# EAGLE design NMX-2017 (EAGLE 8.4.3)
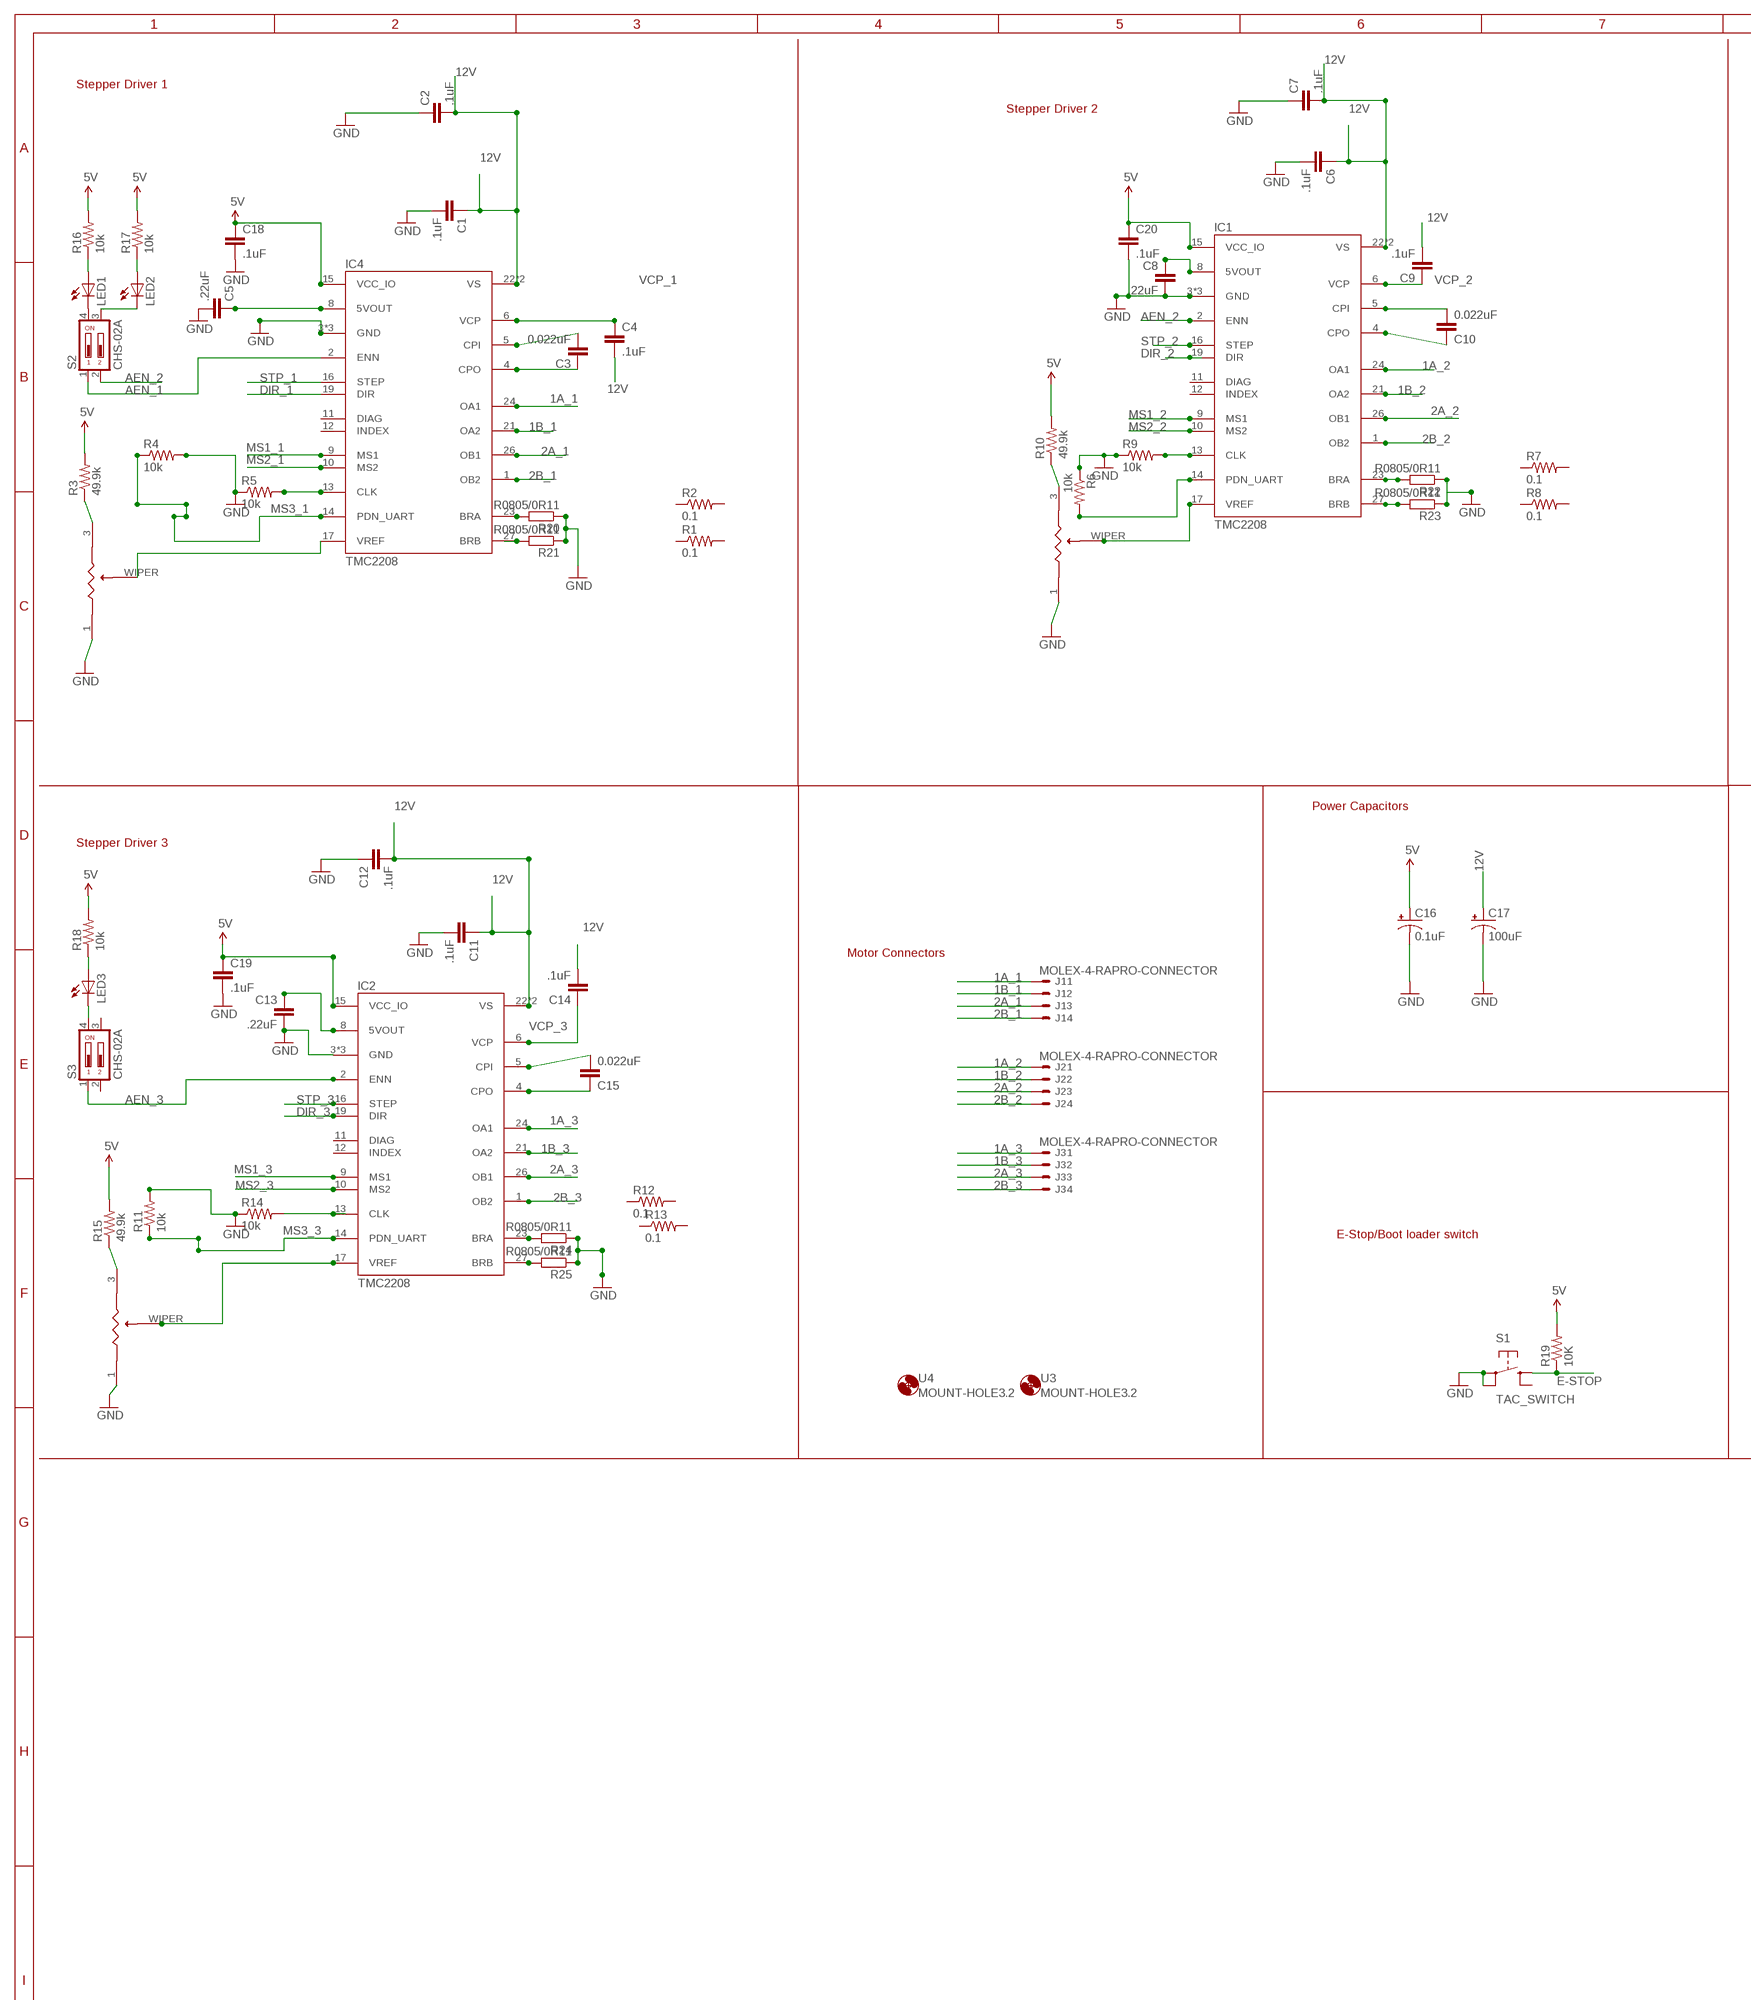
[diagram p0: schematic, sheet 1, part 1 of 2]
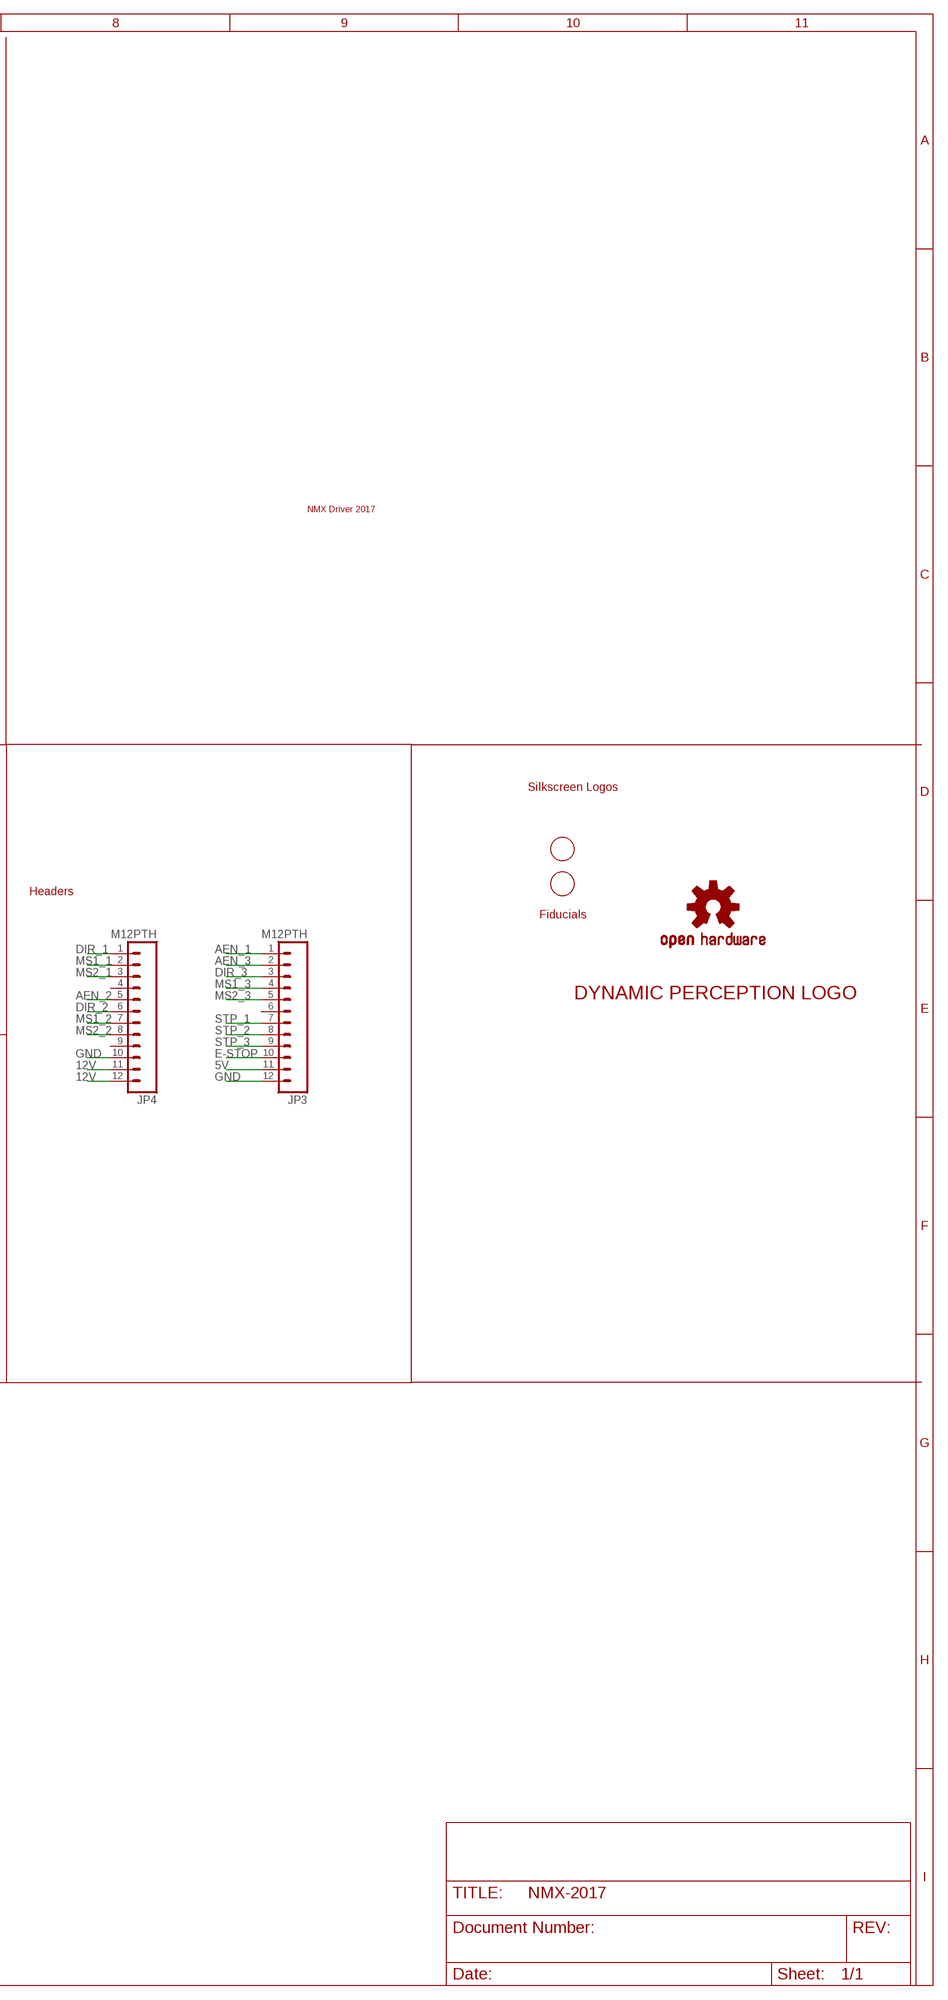
[diagram p1: schematic, sheet 1, part 2 of 2]

## Parts
C1  .1uF  CAP0402-CAP  [0402-CAP]
C2  .1uF  CAP0402-CAP  [0402-CAP]
C3  0.022uF  CAP0402-CAP  [0402-CAP]
C4  .1uF  CAP0402-CAP  [0402-CAP]
C5  .22uF  CAP0402-CAP  [0402-CAP]
C6  .1uF  CAP0402-CAP  [0402-CAP]
C7  .1uF  CAP0402-CAP  [0402-CAP]
C8  .22uF  CAP0402-CAP  [0402-CAP]
C9  .1uF  CAP0402-CAP  [0402-CAP]
C10  0.022uF  CAP0402-CAP  [0402-CAP]
C11  .1uF  CAP0402-CAP  [0402-CAP]
C12  .1uF  CAP0402-CAP  [0402-CAP]
C13  .22uF  CAP0402-CAP  [0402-CAP]
C14  .1uF  CAP0402-CAP  [0402-CAP]
C15  0.022uF  CAP0402-CAP  [0402-CAP]
C16  0.1uF  CAP_POL1206  [EIA3216]
C17  100uF  CAP_POLD  [PANASONIC_D]
C18  .1uF  CAP0402-CAP  [0402-CAP]
C19  .1uF  CAP0402-CAP  [0402-CAP]
C20  .1uF  CAP0402-CAP  [0402-CAP]
IC1  TMC2208  [QFN28-PAD]
IC2  TMC2208  [QFN28-PAD]
IC4  TMC2208  [QFN28-PAD]
J1  MOLEX-4-RAPRO-CONNECTOR  [PRO_CONNECTOR]
J2  MOLEX-4-RAPRO-CONNECTOR  [PRO_CONNECTOR]
J3  MOLEX-4-RAPRO-CONNECTOR  [PRO_CONNECTOR]
JP3  M12PTH  [1X12]
JP4  M12PTH  [1X12]
LED1  LED0603  [LED-0603]
LED2  LED0603  [LED-0603]
LED3  LED0603  [LED-0603]
R1  0.1  R-US_R0603  [R0603]
R2  0.1  R-US_R0603  [R0603]
R3  49.9k  R-US_R0402_B  [R0402_BOTTOM]
R4  10k  R-US_R0402_B  [R0402_BOTTOM]
R5  10k  R-US_R0402_B  [R0402_BOTTOM]
R6  10k  R-US_R0402_B  [R0402_BOTTOM]
R7  0.1  R-US_R0603  [R0603]
R8  0.1  R-US_R0603  [R0603]
R9  10k  R-US_R0402_B  [R0402_BOTTOM]
R10  49.9k  R-US_R0402_B  [R0402_BOTTOM]
R11  10k  R-US_R0402_B  [R0402_BOTTOM]
R12  0.1  R-US_R0603  [R0603]
R13  0.1  R-US_R0603  [R0603]
R14  10k  R-US_R0402_B  [R0402_BOTTOM]
R15  49.9k  R-US_R0402_B  [R0402_BOTTOM]
R16  10k  R-US_R0402_B  [R0402_BOTTOM]
R17  10k  R-US_R0402_B  [R0402_BOTTOM]
R18  10k  R-US_R0402_B  [R0402_BOTTOM]
R19  10K  R-US_R0402_B  [R0402_BOTTOM]
R20  R0805/0R11  R-EU_M0805  [M0805]
R21  R0805/0R11  R-EU_M0805  [M0805]
R22  R0805/0R11  R-EU_M0805  [M0805]
R23  R0805/0R11  R-EU_M0805  [M0805]
R24  R0805/0R11  R-EU_M0805  [M0805]
R25  R0805/0R11  R-EU_M0805  [M0805]
S1  TAC_SWITCH  [TAC_SWITCH_THR]
S2  CHS-02A  [CHS-02A]
S3  CHS-02A  [CHS-02A]
U1  CADJ  TC33X-2  [3MM_SMD]
U2  CADJ  TC33X-2  [3MM_SMD]
U3  MOUNT-HOLE3.2  [3,2]
U4  MOUNT-HOLE3.2  [3,2]
U5  CADJ  TC33X-2  [3MM_SMD]
U$1  DP_LOGOMICRO  [DP_LOGO_MICRO]
U$2  OSHW-LOGOS  [OSHW-LOGO-S]
U$3  FIDUCIAL  [FIDUCIAL_1MM]
U$4  FIDUCIAL  [FIDUCIAL_1MM]

## Nets
1A_1 [StepperPower]: IC4.24(OA1) J1.P$1
1A_2 [StepperPower]: IC1.24(OA1) J2.P$1
1A_3 [StepperPower]: IC2.24(OA1) J3.P$1
1B_1 [StepperPower]: IC4.21(OA2) J1.P$2
1B_2 [StepperPower]: IC1.21(OA2) J2.P$2
1B_3 [StepperPower]: IC2.21(OA2) J3.P$2
2A_1 [StepperPower]: IC4.26(OB1) J1.P$3
2A_2 [StepperPower]: IC1.26(OB1) J2.P$3
2A_3 [StepperPower]: IC2.26(OB1) J3.P$3
2B_1 [StepperPower]: IC4.1(OB2) J1.P$4
2B_2 [StepperPower]: IC1.1(OB2) J2.P$4
2B_3 [StepperPower]: IC2.1(OB2) J3.P$4
5V [vccControllers]: C16.A(+) C18.1 C19.1 C20.1 IC1.15(VCC_IO) IC2.15(VCC_IO) IC4.15(VCC_IO) JP3.11 R3.2 R10.2 R15.2 R16.2 R17.2 R18.2 R19.2
12V [vcc]: C1.1 C2.2 C4.2 C6.1 C7.2 C9.2 C11.1 C12.2 C14.2 C17.+ IC1.22(VS) IC1.28(VS) IC2.22(VS) IC2.28(VS) IC4.22(VS) IC4.28(VS) JP4.11 JP4.12
AEN_1: IC4.2(ENN) JP3.1 S2.1
AEN_2: IC1.2(ENN) JP4.5 S2.2
AEN_3: IC2.2(ENN) JP3.2 S3.1
DIR_1: IC4.19(DIR) JP4.1
DIR_2: IC1.19(DIR) JP4.6
DIR_3: IC2.19(DIR) JP3.3
E-STOP: JP3.10 R19.1 S1.B
GND [gnd]: C1.2 C2.1 C5.2 C6.2 C7.1 C8.2 C11.2 C12.1 C13.2 C16.C(-) C17.- C18.2 C19.2 C20.2 IC1.3(GND) IC1.18(GND) IC1.TP(GND) IC2.3(GND) IC2.18(GND) IC2.TP(GND) IC4.3(GND) IC4.18(GND) IC4.TP(GND) JP3.12 JP4.10 R4.2 R5.1 R6.1 R9.1 R11.2 R14.1 R20.1 R21.1 R22.1 R23.1 R24.1 R25.1 S1.A S1.P$1 U1.1 U2.1 U5.1
MS1_1: IC4.9(MS1) JP4.2
MS1_2: IC1.9(MS1) JP4.7
MS1_3: IC2.9(MS1) JP3.4
MS2_1: IC4.10(MS2) JP4.3
MS2_2: IC1.10(MS2) JP4.8
MS2_3: IC2.10(MS2) JP3.5
MS3_1: IC4.14(PDN_UART) R4.1
MS3_2: IC1.14(PDN_UART) R6.2
MS3_3: IC2.14(PDN_UART) R11.1
N$1: C10.1 IC1.4(CPO)
N$2: C10.2 IC1.5(CPI)
N$5: IC1.17(VREF) U2.WIPER
N$6: R10.1 U2.3
N$7: C15.1 IC2.4(CPO)
N$8: C15.2 IC2.5(CPI)
N$10: IC2.23(BRA) R24.2
N$11: IC2.17(VREF) U5.WIPER
N$12: R15.1 U5.3
N$13: LED1.A R16.1
N$14: LED2.A R17.1
N$15: LED3.A R18.1
N$16: LED1.C S2.4
N$18: LED2.C S2.3
N$19: LED3.C S3.4
N$20: IC2.27(BRB) R25.2
N$21: C3.1 IC4.4(CPO)
N$22: C3.2 IC4.5(CPI)
N$23: IC1.23(BRA) R22.2
N$24 [vcc]: IC4.27(BRB) R21.2
N$26: IC4.17(VREF) U1.WIPER
N$28: R3.1 U1.3
N$29: IC4.23(BRA) R20.2
N$32: IC1.27(BRB) R23.2
ROSC1: IC4.13(CLK) R5.2
ROSC2: IC1.13(CLK) R9.2
ROSC3: IC2.13(CLK) R14.2
STP_1: IC4.16(STEP) JP3.7
STP_2: IC1.16(STEP) JP3.8
STP_3: IC2.16(STEP) JP3.9
VCP_1: C4.1 IC4.6(VCP)
VCP_2: C9.1 IC1.6(VCP)
VCP_3: C14.1 IC2.6(VCP)
VREG1: C5.1 IC4.8(5VOUT)
VREG2: C8.1 IC1.8(5VOUT)
VREG3: C13.1 IC2.8(5VOUT)
Unconnected: IC1.11(DIAG) IC1.12(INDEX) IC2.11(DIAG) IC2.12(INDEX) IC4.11(DIAG) IC4.12(INDEX) JP3.6 JP4.4 JP4.9 R1.1 R1.2 R2.1 R2.2 R7.1 R7.2 R8.1 R8.2 R12.1 R12.2 R13.1 R13.2 S1.P$2 S3.2 S3.3

## Notes on the sheet
- Stepper Driver 1
- Stepper Driver 2
- NMX Driver 2017
- Power Capacitors
- Silkscreen Logos
- Stepper Driver 3
- Headers
- Motor Connectors
- Fiducials
- E-Stop/Boot loader switch

## Library data of the parts
C1-C4 C6 C7 C9-C12 C14 C15 C18-C20 = SparkFun-Capacitors:CAP: Capacitor Standard 0603 ceramic capacitor, and 0.1" leaded capacitor.; MF: Taiyo Yuden; MPN: TMK105BJ104KV-F
C5 C8 C13 = SparkFun-Capacitors:CAP: Capacitor Standard 0603 ceramic capacitor, and 0.1" leaded capacitor.; MF: Taiyo Yuden; MPN: TMK105BJ224KVHF
C16 = SparkFun-Capacitors:CAP_POL: Capacitor Polarized These are standard SMD and PTH capacitors. Normally 10uF, 47uF, and 100uF in electrolytic and tantalum varieties. Always verify the external diameter of the through hole cap, it varies with capacity, voltage, and manufacturer. The EIA devices should be standard.; MF: Kemet; MPN: T491A106M016AT
C17 = SparkFun-Capacitors:CAP_POL: Capacitor Polarized These are standard SMD and PTH capacitors. Normally 10uF, 47uF, and 100uF in electrolytic and tantalum varieties. Always verify the external diameter of the through hole cap, it varies with capacity, voltage, and manufacturer. The EIA devices should be standard.; MF: Panasonic Electronic Components; MPN: EEE-1EA101XP
IC1 IC2 IC4 = we-chip:TMC2208: Trinamic TMC2108 Stepper Motor Driver (5V...36V, 1.2A RMS, 256 microsteps)
J1-J3 = NMX_StepperSide_V1-2:MOLEX-4-RA; MF: Molex Inc; MPN: 0022053041
JP3 JP4 = SparkFun-Connectors:M12: Header 12 Standard 12-pin 0.1" header. Use with straight break away headers (SKU : PRT-00116), right angle break away headers (PRT-00553), swiss pins (PRT-00743), machine pins (PRT-00117), and female headers (PRT-00115).; MF: Molex Inc; MPN: 0901200132
LED1-LED3 = SparkFun-LED:LED: LEDs Standard schematic elements and footprints for 5mm, 3mm, 1206, and 0603 sized LEDs. 5mm - Spark Fun Electronics SKU : COM-00529 (and others); MF: OSRAM Opto Semiconductors Inc; MPN: LB Q39G-L2N2-35-1
R1 R2 R7 R8 R12 R13 = resistor:R-US_: RESISTOR, American symbol; MF: Samsung Electro-Mechanics America; MPN: RU1608FR100CS
R3 R10 R15 = resistor:R-US_: RESISTOR, American symbol; MF: Yageo; MPN: RC0402FR-0749K9L
R4-R6 R9 R11 R14 = resistor:R-US_: RESISTOR, American symbol; MF: Yageo; MPN: RC0402FR-0720KL
R16-R18 = resistor:R-US_: RESISTOR, American symbol; MF: Yageo; MPN: RC0402FR-0714KL
R19 = resistor:R-US_: RESISTOR, American symbol; MF: Yageo; MPN: RC0402FR-0710KL
R20-R25 = rcl:R-EU_: RESISTOR, European symbol
S1 = QS_Components:TAC_SWITCH; MF: TE Connectivity; MPN: 2-1825027-0
S2 S3 = switch-copal:CHS-02: Copal Electronics, Distributor Bürklin
U1 U2 U5 = QS_Components:TC33X-2; MF: Bourns Inc; MPN: TC33X-2-103E
U3 U4 = holes:MOUNT-HOLE: MOUNTING HOLE with drill center marker
U$1 = QS_Components:DP_LOGO
U$2 = SparkFun-Aesthetics:OSHW-LOGO: Open Source Hardware Logo This logo indicates the piece of hardware it is found on incorporates a OSHW license and/or adheres to the definition of open source hardware found here: http://freedomdefined.org/OSHW
U$3 U$4 = adafruit:FIDUCIAL: For use by pick and place machines to calibrate the vision/machine, 1mm By microbuilder.eu

## Net classes
0 default: width 0.203 mm, drill 0.254 mm, clearance 0.152 mm
1 vcc: width 0.635 mm, drill 0.254 mm, clearance 0.152 mm
2 gnd: width 0.254 mm, drill 0.254 mm, clearance 0.152 mm
3 vccControllers: width 0.305 mm, drill 0.254 mm, clearance 0.152 mm
4 StepperPower: width 0.635 mm, drill 0.254 mm, clearance 0.152 mm

## Board
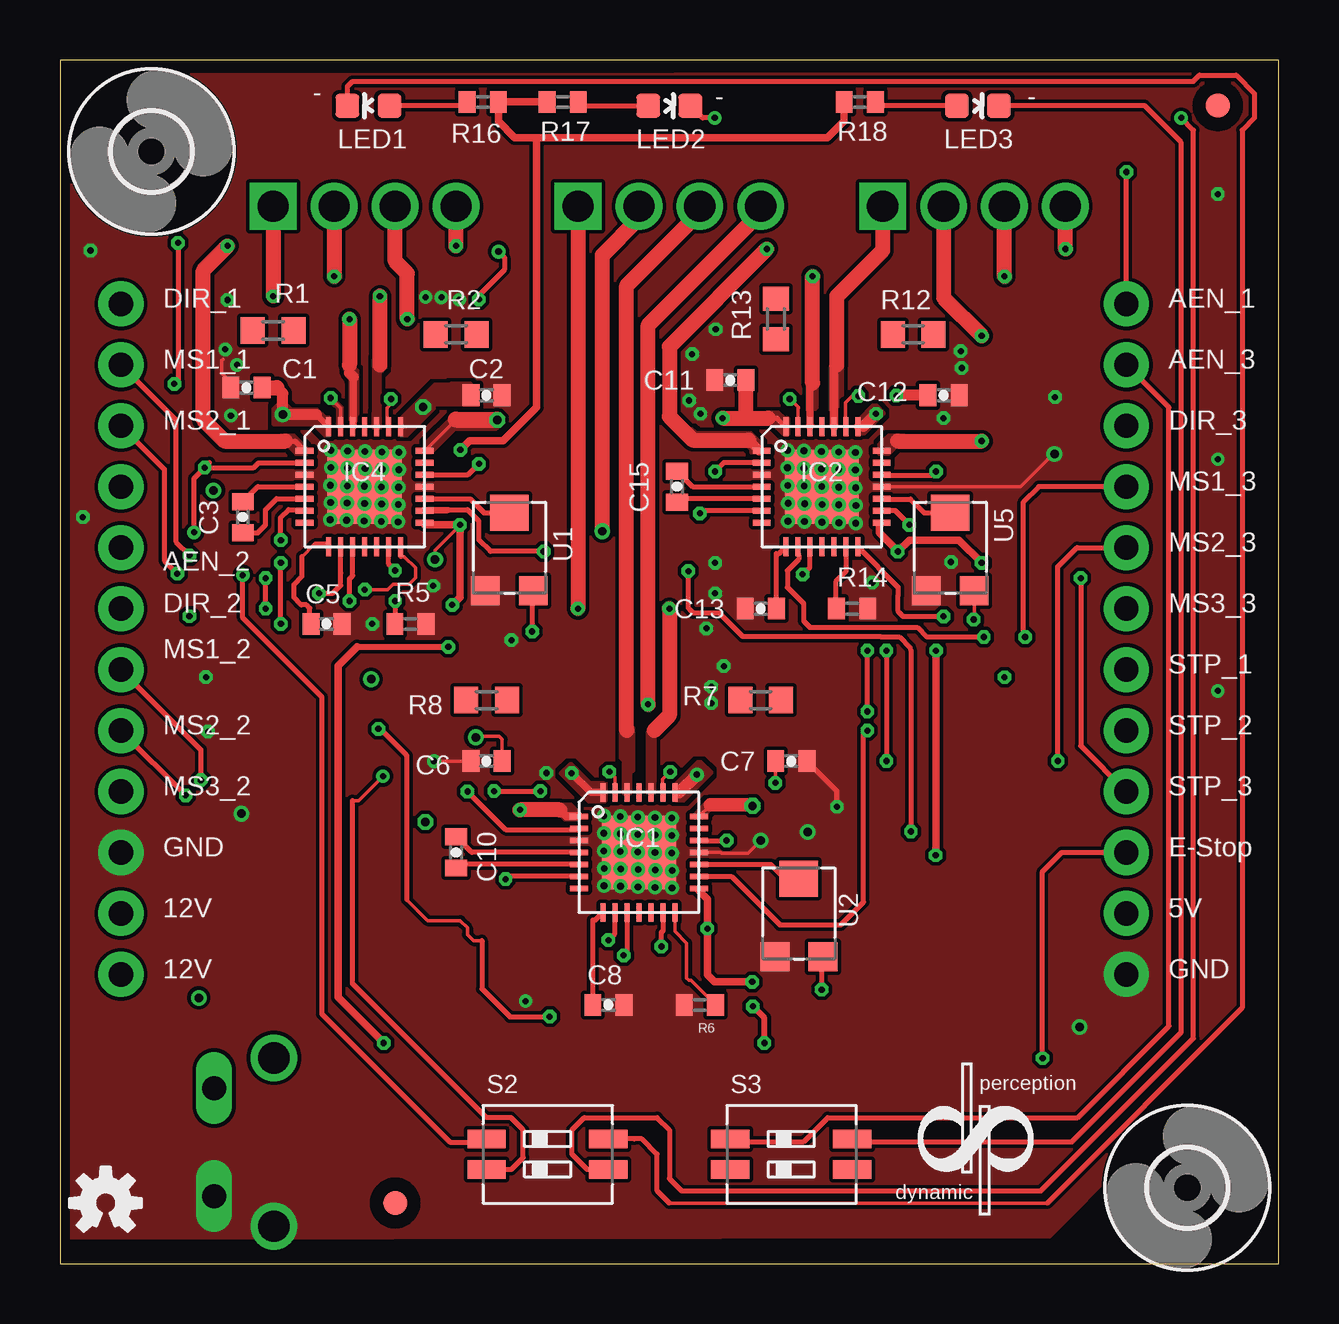
[diagram p2: board, top side]
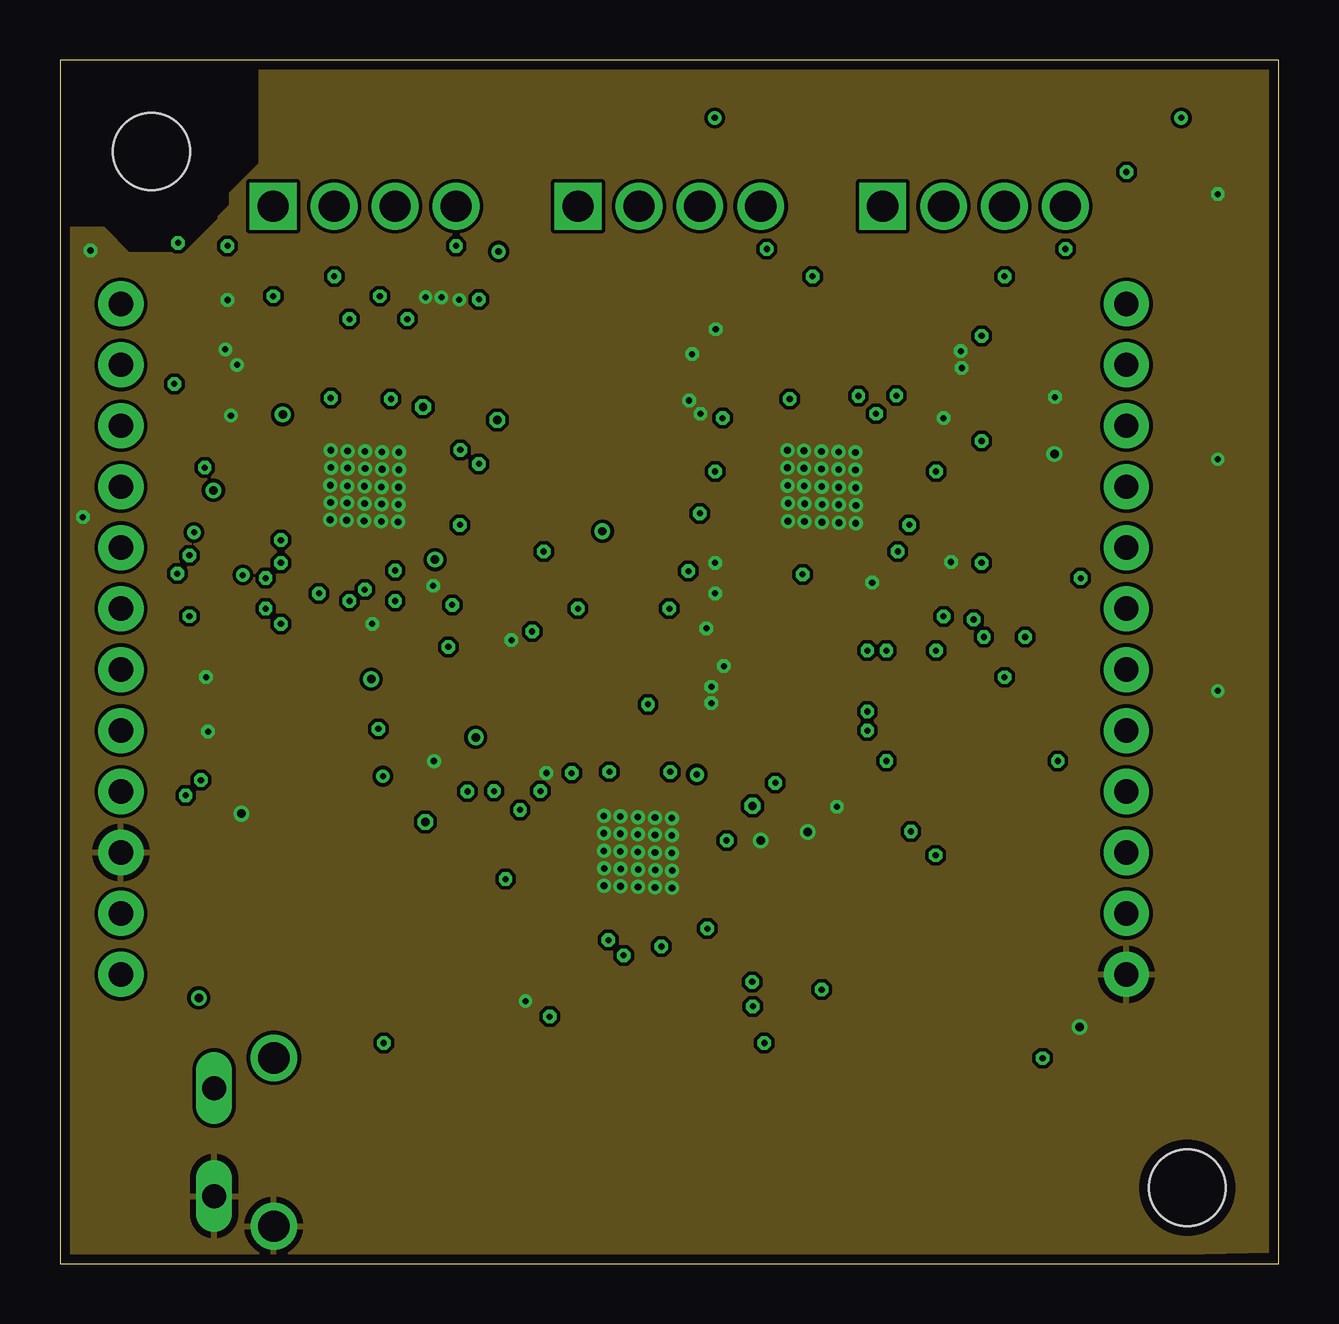
[diagram p3: board, inner layer Ground]
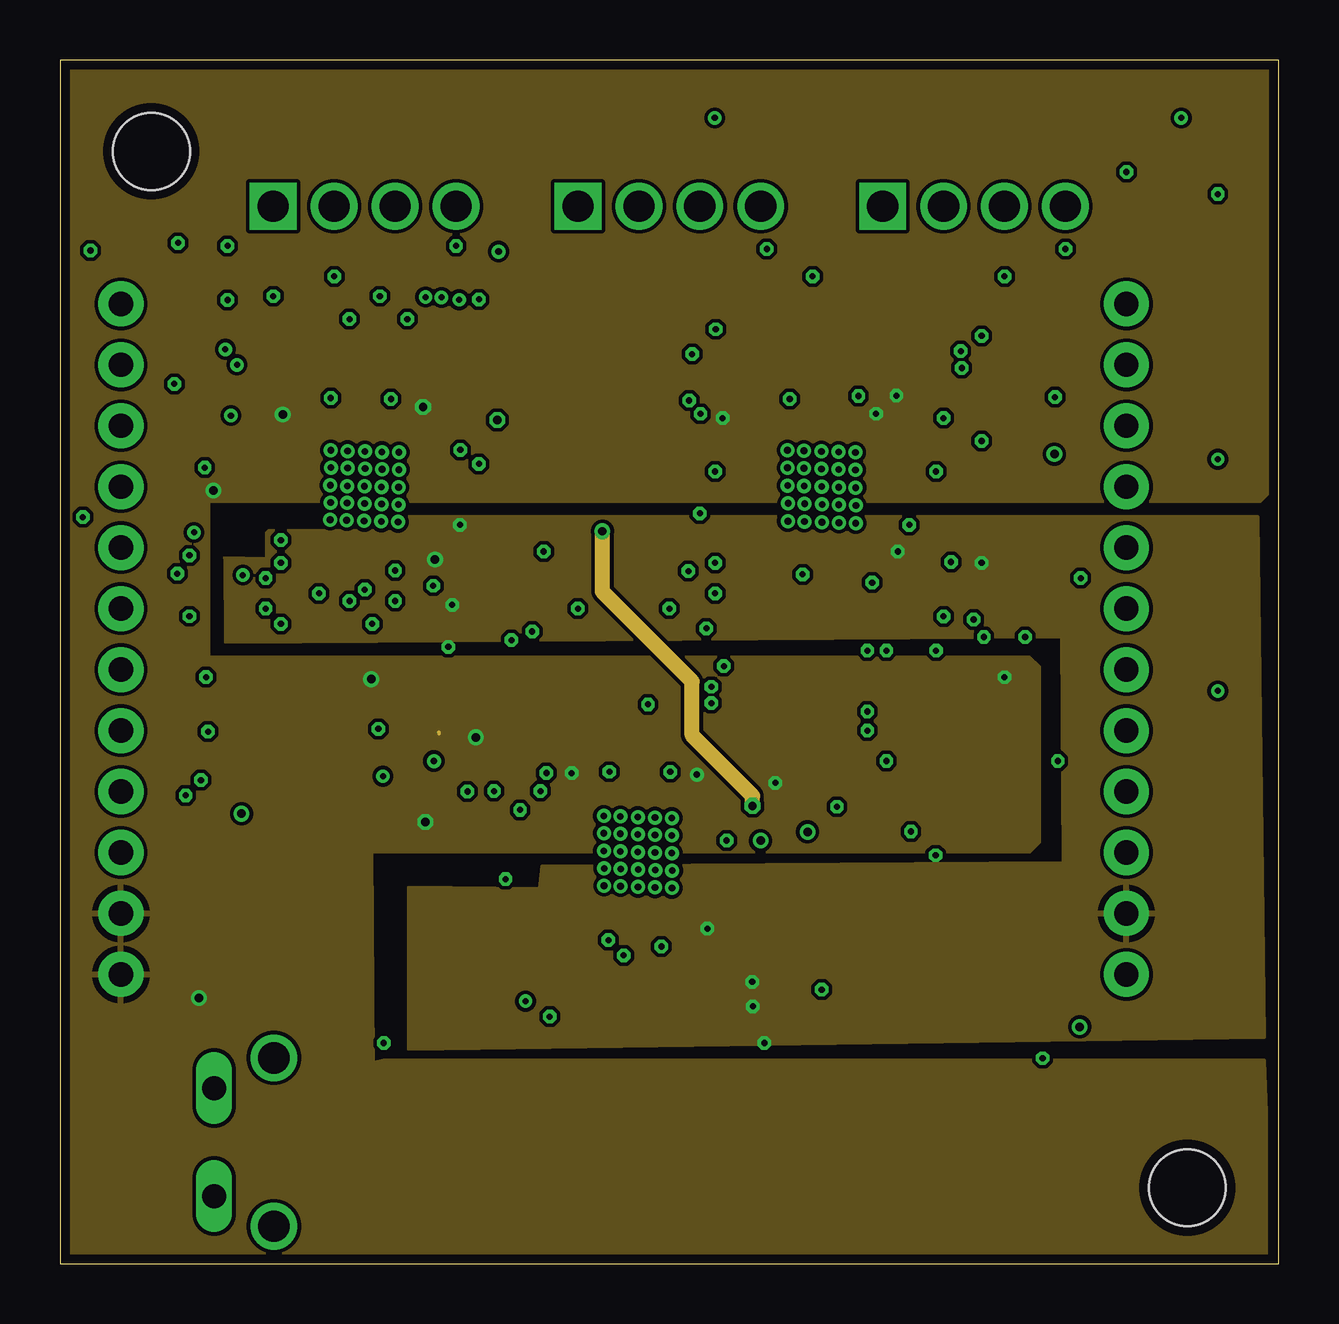
[diagram p4: board, inner layer Power]
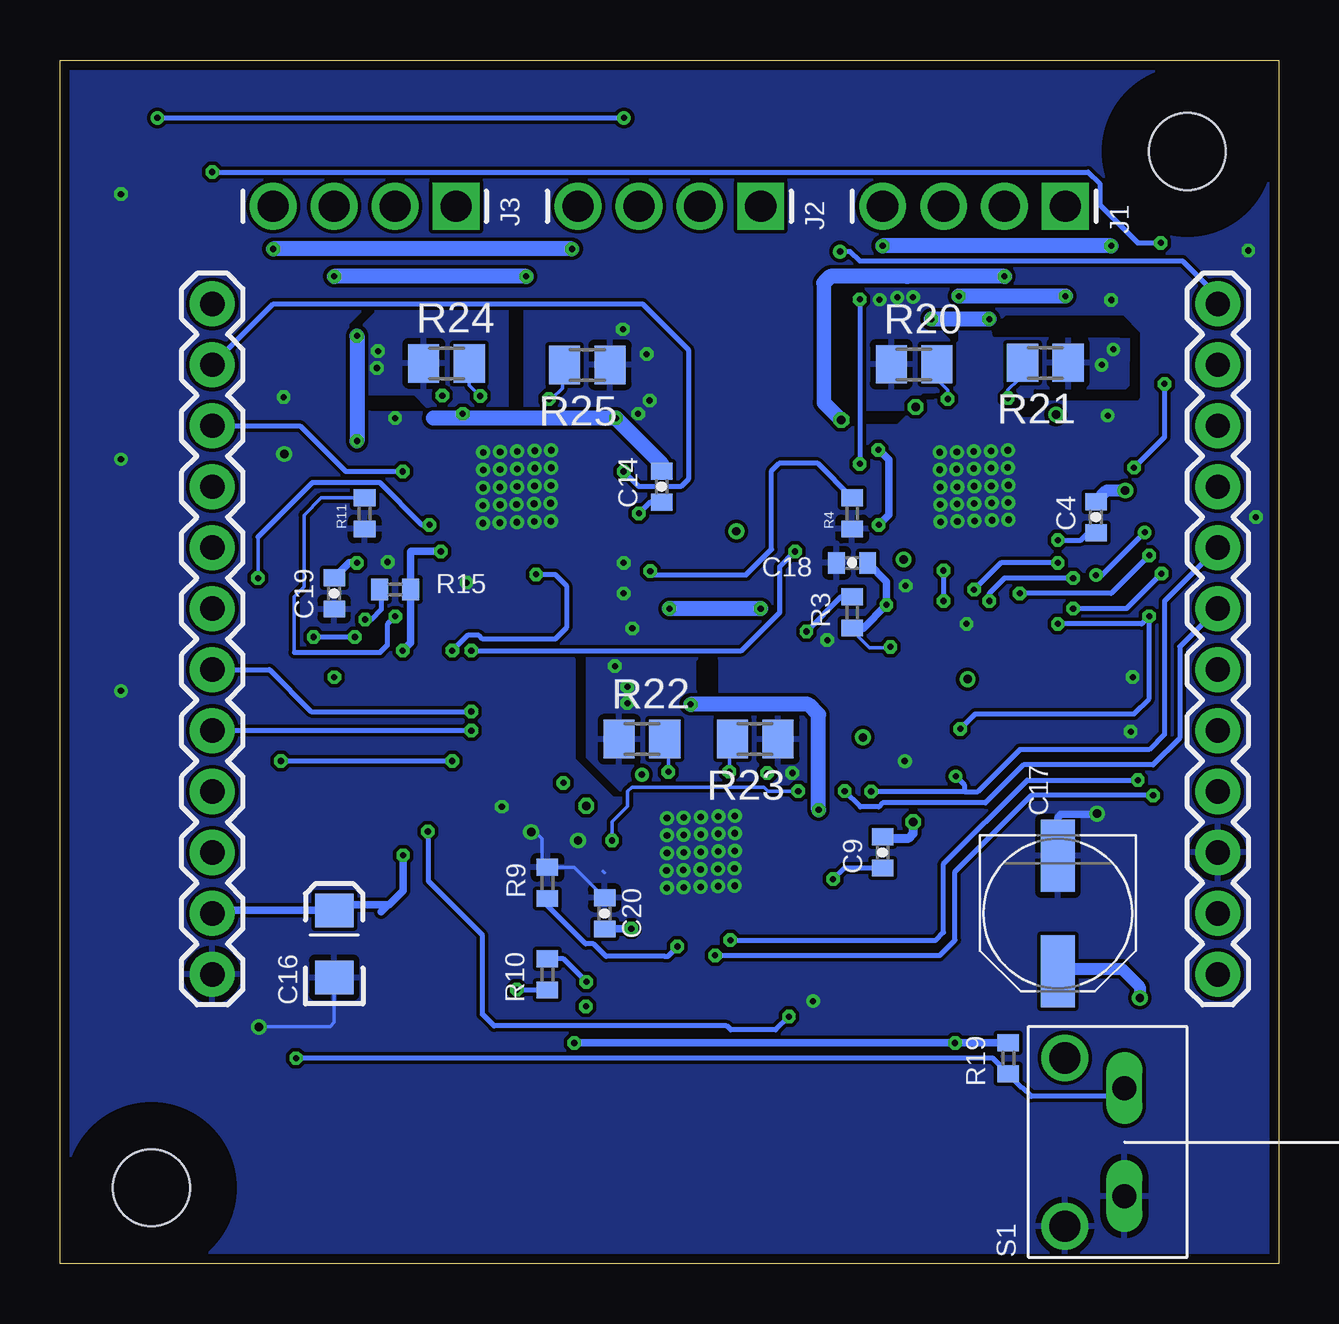
[diagram p5: board, bottom side, seen from below]

Size 50.8 x 50.16 mm. Coordinates in mm from the lower left corner, seen from the top.
Outline: 0,0 50.8,0 50.8,50.16 0,50.16 0,0
Copper layers (1*2+15*16): Top 0.035mm / dielectric 0.35mm / Ground 0.035mm / dielectric 0.76mm / Power 0.035mm / dielectric 0.35mm / Bottom 0.035mm
Design rules "default *": minimum track width 0.15mm, minimum drill 0.25mm, track to track 0.15mm, track to pad 0.15mm, pad to pad 0.15mm, via to via 0.15mm, smd to smd 0mil, copper to edge 0.4mm, drill to drill 8mil, minimum pad ring 10mil, minimum via ring 6mil, stop-mask expansion 2mil, vias tented up to drill 0.5mm, thermal gap 10mil

### Footprints (pad centres in the part's own frame; a part is rotated, then mirrored left to right if it is on the bottom)
0402-CAP = smd 0.7 x 0.9: 1 -0.65,0; 2 0.65,0
EIA3216 = smd 1.4 x 1.6: A 1.4,0; C -1.4,0
PANASONIC_D = smd 3 x 1.4: + 2.4,0; - -2.4,0
QFN28-PAD = smd 0.8 x 0.26: 1 -2.5,1.5; 2 -2.5,1; 3 -2.5,0.5; 4 -2.5,0; 5 -2.5,-0.5; 6 -2.5,-1; 7 -2.5,-1.5; 15 2.5,-1.5; 16 2.5,-1; 17 2.5,-0.5; 18 2.5,0; 19 2.5,0.5; 20 2.5,1; 21 2.5,1.5 | smd 0.26 x 0.8: 8 -1.5,-2.5; 9 -1,-2.5; 10 -0.5,-2.5; 11 0,-2.5; 12 0.5,-2.5; 13 1,-2.5; 14 1.5,-2.5; 22 1.5,2.5; 23 1,2.5; 24 0.5,2.5; 25 0,2.5; 26 -0.5,2.5; 27 -1,2.5; 28 -1.5,2.5 | smd 3.1 x 3.1: TP 0,0
PRO_CONNECTOR = drill 1.3 square: P$1 0,3.81 | drill 1.3: P$2 0,1.27; P$3 0,-1.27; P$4 0,-3.81
1X12 = drill 1.016 pad 1.88: 1 0,0; 2 2.54,0; 3 5.08,0; 4 7.62,0; 5 10.16,0; 6 12.7,0; 7 15.24,0; 8 17.78,0; 9 20.32,0; 10 22.86,0; 11 25.4,0; 12 27.94,0
LED-0603 = smd 1 x 1: A 0,-0.877; C 0,0.877
R0603 = smd 1 x 1.1: 1 -0.85,0; 2 0.85,0
R0402_BOTTOM = smd 0.7 x 0.9 bottom: 1 -0.65,0; 2 0.65,0
M0805 = smd 1.3 x 1.6: 1 -0.95,0; 2 0.95,0
TAC_SWITCH_THR = drill 1 long: A -2.25,0; B 2.25,0 | drill 1.3: P$1 -3.505,2.49; P$2 3.505,2.49
CHS-02A = smd 0.76 x 1.6: 1 -0.635,-2.54; 2 0.635,-2.54; 3 0.635,2.54; 4 -0.635,2.54
3MM_SMD = smd 1.2 x 1.2: 1 -1.8,1; 3 -1.8,-1 | smd 1.5 x 1.6: WIPER 1.45,0
3,2 = hole 3.2: 0,0
FIDUCIAL_1MM = smd 1 x 1: 1 0,0

### Placement (x,y rotation side)
C1  7.78,36.51 180 top
C2  17.78,36.2 180 top
C3  7.62,31.11 270 top
C4  7.62,31.11 90 bottom
C5  11.11,26.67 0 top
C6  17.78,20.95 180 top
C7  30.48,20.95 180 top
C8  22.86,10.79 0 top
C9  16.51,17.14 90 bottom
C10  16.51,17.14 270 top
C11  27.94,36.83 180 top
C12  36.83,36.2 180 top
C13  29.21,27.3 180 top
C14  25.72,32.38 90 bottom
C15  25.72,32.38 270 top
C16  39.37,13.34 90 bottom
C17  9.21,14.61 270 bottom
C18  17.78,29.21 180 bottom
C19  39.37,27.94 270 bottom
C20  28.1,14.61 90 bottom
IC1  24.13,17.14 0 top
IC2  31.75,32.38 0 top
IC4  12.7,32.39 0 top
J1  12.7,44.07 270 bottom
J2  25.4,44.07 270 bottom
J3  38.1,44.07 270 bottom
JP3  44.45,40.01 270 bottom
JP4  2.54,40.01 270 bottom
LED1  12.86,48.26 90 top
LED2  25.4,48.26 270 top
LED3  38.26,48.26 270 top
R1  8.89,38.89 180 top
R2  16.51,38.73 0 top
R3  17.78,27.15 270 top
R4  17.78,31.27 270 top
R5  14.61,26.67 0 bottom
R6  26.67,10.79 180 bottom
R7  29.21,23.5 0 top
R8  17.78,23.5 180 top
R9  30.48,15.88 270 top
R10  30.48,12.06 90 top
R11  38.1,31.27 270 top
R12  35.56,38.73 0 top
R13  29.84,39.37 90 top
R14  33.02,27.3 0 bottom
R15  36.83,28.1 180 top
R16  17.62,48.42 180 bottom
R17  20.95,48.42 0 bottom
R18  33.34,48.42 0 bottom
R19  11.27,8.57 90 top
R20  15.2,37.49 0 bottom
R21  9.73,37.55 180 bottom
R22  26.54,21.87 0 bottom
R23  21.82,21.87 180 bottom
R24  34.69,37.53 0 bottom
R25  28.82,37.46 180 bottom
S1  6.43,5.08 90 bottom
S2  20.32,4.57 270 top
S3  30.48,4.57 270 top
U1  18.73,29.84 90 top
U2  30.8,14.61 90 top
U3  46.99,3.17 0 top
U4  3.81,46.35 0 top
U5  37.11,29.84 90 top
U$1  38.1,5.08 0 top
U$2  1.91,2.54 0 top
U$3  13.97,2.54 0 top
U$4  48.26,48.26 0 top

### Tracks (layer width: path | path; a pad name or v marks a point on that pad's centre or on a via)
1A_1  (via drill 0.25)
  Top 0.203: 13.17,34.92 IC4.24
  Top 0.635: J1.P$1 v8.89,40.32 | 13.34,37.47 v13.34,40.32
  Bottom 0.635: v8.89,40.32 v13.34,40.32
  pour Top (no thermals): 13.05,35.43 13.05,34.83 13.37,34.83 13.38,34.84 13.38,35.7 13.34,35.74 13.34,36.78 13.35,36.79 13.35,37.11 13.58,37.34 13.58,37.7 13.56,37.72 13.09,37.72 13.07,37.69 13.07,35.45 13.05,35.44
1A_2  (via drill 0.25)
  Top 0.152: 24.63,22.23 24.77,22.23
  Top 0.203: 24.63,22.09 24.77,22.23
  Top 0.635: J2.P$1 v21.59,27.3 | v25.4,27.3 25.4,22.86 24.77,22.23
  Bottom 0.635: v21.59,27.3 v25.4,27.3
  pour Top (no thermals): 24.48,19.65 24.47,19.64 24.79,19.64 24.8,19.65 24.8,22.17 24.83,22.2 24.51,22.2 24.49,22.17 24.49,20.18 24.49,20.18
1A_3
  Top 0.203: 32.25,37.33 32.38,37.47
  Top 0.356: IC2.24 32.25,37.33
  Top 0.635: J3.P$1 34.29,42.23 32.38,40.32 32.38,37.47
  pour Top: 32.61,37.45 32.61,36.2 32.6,36.2 32.58,36.2 32.43,36.05 32.43,35.72 32.37,35.65 32.37,35.05 32.36,35.04 32.13,35.04 32.11,35.03 32.11,37.41 32.14,37.44 32.6,37.44
1B_1  (via drill 0.25, 0.35)
  Top 0.152: 18.21,35.18 v18.23,35.16 | IC4.21 15.22,33.89 16.51,35.18
  Top 0.635: J1.P$2 v11.43,41.15
  Top 0.66: 16.51,35.18 18.21,35.18
  Bottom 0.61: v18.23,35.16 18.96,35.89 18.96,40.88
  Bottom 0.635: v11.43,41.15 15.49,41.15 18.69,41.15 18.96,40.88
  pour Top (no thermals): 15.21,33.93 15.21,34.17 16.47,35.43 16.47,34.78 15.5,33.81 15.22,33.81 15.21,33.82 15.21,33.92 15.21,33.93
  pour Top: 16.47,35.13 16.47,34.79 16.48,34.78 18.18,34.78 18.23,34.83 18.23,34.86 17.73,35.36 16.72,35.36 16.47,35.11
1B_2  (via drill 0.35)
  Top 0.152: v28.86,19.09 28.82,19.13 | 27.11,19.13 27.11,19.12 IC1.21
  Top 0.559: 28.82,19.13 27.11,19.13
  Top 0.635: v22.61,30.53 22.61,42.04 24.13,43.56 J2.P$2
  Power 0.635: v28.86,19.09 28.86,19.5 26.35,22.02 26.35,24.27 22.61,28.02 v22.61,30.53
  pour Top (no thermals): 26.46,18.61 26.46,18.76 27.03,19.33 27.03,18.94 27.05,18.92 27.05,18.87 26.76,18.58 26.47,18.58 26.47,18.57
1B_3  (via drill 0.25)
  Top 0.635: 34.92,34.29 v38.42,34.29 | J3.P$2 36.83,40.26 v38.42,38.67
  Bottom 0.635: v38.42,38.67 v38.42,34.29
  pour Top (no thermals): 34.14,34.02 34.14,34.15 34.52,34.54 35.16,34.54 35.17,34.55 35.17,34.03 35.18,34.02 34.84,34.02 34.56,33.75 34.14,33.75 34.13,33.74 34.13,33.99 34.13,33.99
2A_1  (via drill 0.25)
  Top 0.203: 12.22,34.91 IC4.26
  Top 0.305: 12.22,36.96 12.22,34.91 | 12.06,37.47 12.06,37.12
  Top 0.457: 12.06,37.12 12.22,36.96
  Top 0.635: v12.06,39.37 12.06,37.47 | v14.48,39.37 14.48,41.28 13.97,41.78 J1.P$3
  Bottom 0.635: v12.06,39.37 v14.48,39.37
  pour Top (no thermals): 12.31,37.35 12.31,37.33 12.41,37.23 12.41,35.5 12.4,35.16 12.1,35.16 12.09,35.48 12.09,36.85 12.07,36.88 12.07,37.06 11.85,37.28 12.21,37.28 12.27,37.34
2A_2
  Top 0.152: 23.63,22.23 23.62,22.23 | 26.67,43.81 J2.P$3
  Top 0.635: 23.62,22.23 23.62,40.77 26.67,43.81
  pour Top (no thermals): 23.49,20.2 23.49,19.59 23.49,19.59 23.78,19.59 23.79,19.59 23.79,20.32 23.79,20.32 23.79,20.44 23.9,20.55 23.9,22.33 23.89,22.35 23.41,22.35 23.36,22.3 23.36,21.08 23.5,20.94 23.5,20.23 23.49,20.22
2A_3  (via drill 0.25)
  Top 0.203: 31.25,36.58 31.37,36.7
  Top 0.305: IC2.26 31.25,36.58
  Top 0.635: 31.37,36.7 v31.37,41.15 | v39.37,41.15 J3.P$3
  Bottom 0.635: v31.37,41.15 v39.37,41.15
  pour Top: 31.62,37.34 31.38,37.34 31.34,37.37
  pour Top: 31.56,36.65 31.56,35.75 31.55,35.74 31.55,35.67 31.42,35.53 31.42,35.03 31.35,34.97 31.16,34.97 31.15,34.97 31.15,36.67 31.21,36.73 31.48,36.73 31.53,36.68
2B_1  (via drill 0.25)
  Top 0.203: 9.4,34.29 9.79,34.29 IC4.1
  Top 0.635: 9.4,34.29 6.86,34.29 5.97,35.18 5.97,41.4 v6.99,42.42 | v16.51,42.42 J1.P$4
  Bottom 0.635: v6.99,42.42 v16.51,42.42
  pour Top (no thermals): 9.2,34.53 9.75,34.53 10.23,34.05 10.23,33.73 10.24,33.72 9.84,33.72 9.84,33.74 9.52,34.06 9.21,34.06 9.2,34.06 9.2,34.52 9.21,34.52
2B_2  (via drill 0.25)
  Top 0.152: 29.21,43.81 J2.P$4
  Top 0.356: IC1.1 21.11,18.64 20.83,18.92
  Top 0.635: v24.51,23.32 24.51,39.12 29.21,43.81 | 20.83,18.92 v19.18,18.92
  Bottom 0.152: 19.18,22.89 19.61,23.32
  Bottom 0.635: v24.51,23.32 19.61,23.32 19.2,22.91 | v19.18,18.92 19.18,22.89
  pour Top: 21.6,18.53 21.05,18.53 20.88,18.69
  pour Top (no thermals): 20.64,19.15 21.3,19.15 21.62,18.84 21.62,18.52 21.63,18.51 21.04,18.51 20.91,18.64 20.91,18.67 20.89,18.69 20.64,18.69 20.63,18.68 20.63,19.14 20.63,19.15
2B_3  (via drill 0.25)
  Top 0.152: IC2.1 29.15,33.88
  Top 0.406: 28.71,34.33 29.15,33.88
  Top 0.635: v29.46,42.29 25.4,38.23 25.4,35.31 26.38,34.33 28.71,34.33 | v41.91,42.29 J3.P$4
  Bottom 0.635: v29.46,42.29 v41.91,42.29
  pour Top (no thermals): 26.58,34.63 28.81,34.63 29.25,34.18 29.25,33.82 29.28,33.79 28.8,33.79 28.8,33.93 28.59,34.14 26.34,34.14 26.12,34.36 26.12,34.63 26.31,34.83 26.33,34.83 26.53,34.63
5V  (via drill 0.25, 0.35)
  Top 0.152: v16.67,30.8 16.67,30.77 15.63,29.74 v15.63,29.35 | IC4.15 15.19,30.87 15.19,30.8 | v36.5,17.03 36.51,17.04 | 19.86,35.69 | R18.2
  Top 0.203: 26.63,15.54 IC1.15
  Top 0.254: v29.36,9.21 29.36,10.25 v28.88,10.73 | 12.38,25.71 v16.19,25.71
  Top 0.305: 15.19,30.8 v16.67,30.8 16.67,27.78 v16.35,27.46 | 12.38,25.71 11.59,24.92 11.59,11.11 v13.49,9.21 | R17.2 R16.2 18.27,47.61 18.95,46.93 19.86,46.93 | 19.86,46.93 32,46.93 32.68,47.61 R18.2 | v38.42,29.21 37.47,30.16 35.4,30.16 v34.92,29.69 34.15,30.46 34.15,30.79 IC2.15 | 19.86,35.69 19.86,46.93 | v28.86,11.75 27.29,11.75 26.99,12.05 v26.99,13.97 26.99,15.19 26.63,15.54 | 36.51,17.04 v36.51,25.56 | v16.69,33.92 17.07,34.31 18.48,34.31 19.86,35.69
  Power 0.152: v15.63,29.35 v15.64,29.35 15.65,29.34 | v28.88,10.73 28.9,10.73 28.91,10.71
  Bottom 0.152: v16.19,25.71 16.22,25.68 17.06,25.68 17.51,26.14 17.51,26.5
  Bottom 0.203: 16.67,33.92 v16.69,33.92 | v28.86,11.75 29.82,12.71 R10.2 | 37.12,14.97 37.08,14.97 | 39.14,14.97 C16.A
  Bottom 0.305: R3.2 17.51,26.5 17.32,26.5 v16.35,27.46 16.35,28.43 C18.1 | v29.36,9.21 v13.49,9.21 13.49,9.22 R19.2 | R10.2 30.46,12.7 | C16.A 44.32,14.73 JP3.11 | v34.92,29.69 36.16,29.69 36.18,29.67 R15.2 36.18,25.89 v36.51,25.56 | C19.1 38.75,29.21 v38.42,29.21 | v26.99,13.97 28.08,13.97 C20.1 | v16.67,30.8 16.25,31.21 16.25,33.5 16.67,33.92 | v36.5,17.03 36.5,15.55 37.08,14.97 | 39.14,14.97 37.12,14.97 37.41,14.68
  pour Power: 6.84,29.43 8.58,29.39 8.62,29.43 8.62,30.46 8.71,30.55 14.52,30.54 14.53,31.16 49.92,31.13 50.19,9.45 14.52,8.95 14.52,15.69 19.99,15.64 20.1,16.57 41.82,16.71 41.76,26.14 6.9,25.91 6.89,29.4
12V  (via drill 0.25, 0.28, 0.35)
  Top 0.152: C7.2 v29.83,20.06 v29.82,20.05 | C6.1 18.43,21.86 18.3,21.99 17.38,21.99 v17.33,21.94 | 34.88,36.2 v34.86,36.18 | IC4.22 14.41,34.89 | 17.09,36.16 C2.2 | 28.61,35.24 28.59,35.23
  Top 0.203: 33.3,34.88 IC2.22 | 29.53,35.24 29.89,35.24 IC2.28
  Top 0.254: IC4.28 10.69,35.39
  Top 0.305: IC1.28 22.14,19.64 v21.33,20.45
  Top 0.356: IC2.22 33.48,34.88
  Top 0.457: 9.05,36.51 9.29,36.28 v9.29,35.39 10.69,35.39 | C12.2 34.88,36.2 | 33.48,34.88 v34.02,35.42
  Top 0.508: 25.8,19.64 v26.55,20.39
  Top 0.635: C1.1 9.05,36.51 | 28.59,35.23 C11.1 | 29.53,35.24 28.61,35.24 v27.62,35.24
  Power 0.152: v15.23,18.42 15.3,18.42 15.31,18.42 | 15.79,22.1 15.79,22.15
  Bottom 0.152: 15.29,18.52 15.29,18.48 v15.23,18.42 | C9.2 16.46,17.74 | C17.+ 9.12,12.3
  Bottom 0.381: 16.46,17.74 15.43,17.74 15.23,17.94 v15.23,18.42
  Bottom 0.508: C4.2 7.16,32.23 v6.4,32.23 | 9.12,12.3 6.55,12.3 5.79,11.54 v5.79,11.08
  Bottom 0.635: C14.2 25.72,33.34 v27.62,35.24 35.24,35.24 | 16.5,17.78 C9.2
  other vias: 39.37,24.45 12.97,24.37 15.13,35.71
  pour Power: 0.45,49.75 50.55,49.75 50.55,32.29 50.03,31.78 6.31,31.78 6.2,31.89 6.2,25.35 6.28,25.28 40.41,25.28 40.81,24.87 40.81,17.58 40.42,17.18 13.07,17.18 13,17.25 13.05,8.39 13.48,8.49 50.19,8.49 50.27,6.33 50.27,0.42 50.27,0.42 0.39,0.42 0.35,0.38 0.35,49.68 0.53,49.86
  pour Top: 16.91,35.84 16.94,35.86 16.94,36.52 16.93,36.53
  pour Top (no thermals): 14.21,34.51 14.48,34.51 15.59,35.62 15.59,35.72 15.63,35.81 17.04,35.81 17.13,35.85 17.13,36.67 17.11,36.69 16.3,36.69 16.26,36.65 15.61,36.65 14.22,35.26 14.22,34.55 14.24,34.53
  pour Top (no thermals): 29.55,35.5 29.95,35.5 30.2,35.25 30.35,35.25 30.37,35.24 30.37,34.58 30.36,34.57 30.14,34.57 29.71,34.99 29.44,34.99 29.39,35.04 29.39,35.35 29.52,35.48
  pour Top (no thermals): 33.29,35.19 33.29,34.63 33.33,34.59 33.52,34.59 34.35,35.42 34.35,35.47 34.05,35.77 33.87,35.77 33.3,35.2
  pour Top (no thermals): 22.76,20.07 22.76,19.29 22.73,19.26 22.03,19.26 20.85,20.44 20.85,20.44 21.27,20.87 21.3,20.87 22.11,20.06 22.75,20.06
  pour Top (no thermals): 25.67,20.01 25.67,19.31 25.68,19.3 26.01,19.3 27.15,20.44 27.15,20.51 26.73,20.93 26.57,20.93 25.67,20.04
  pour Top (no thermals): 8.88,35.62 8.88,34.99 8.91,34.96 10.57,34.96 11.03,34.5 11.22,34.5 11.22,34.69 11.22,35.29 11.04,35.3 10.72,35.62 9.66,35.62 9.47,35.81 9.05,35.81 8.88,35.64
AEN_1  (via drill 0.25)
  Top 0.152: IC4.2 10.18,33.37
  Top 0.203: JP3.1 v44.45,45.5 | v4.92,42.55 4.92,36.83 v4.76,36.67 | 6.24,33.38 v6.03,33.18 | v7.62,28.7 7.62,26.92 10.92,23.62 10.92,10.41 16.26,5.08 17.65,5.08 S2.1 | v5.59,30.48 5.59,32.73 v6.03,33.18 | v6.03,33.18 8.08,33.18 8.27,33.37 10.18,33.37
  Bottom 0.203: v44.45,45.5 7.94,45.5 7.46,45.02 7.46,44.13 5.87,42.55 v4.92,42.55 | v4.76,36.67 4.76,34.45 v6.03,33.18 | v7.62,28.7 7.37,28.7 v5.59,30.48
AEN_2  (via drill 0.25)
  Top 0.152: 12.19,19.3 12.45,19.3 v13.46,20.32
  Top 0.203: v16.99,19.68 18.57,18.1 21.58,18.1 IC1.2 | 12.19,19.3 12.19,11.68 17.78,6.1 18.8,6.1 19.3,5.59 19.3,4.43 18.82,3.94 S2.2
  Bottom 0.203: 13.11,19.68 12.54,19.68 10.79,21.43 5.4,21.43 4.76,22.07 4.76,27.62 JP4.5 | 13.11,19.68 v16.99,19.68 | v13.46,20.32 13.11,19.97 13.11,19.68
AEN_3  (via drill 0.25)
  Top 0.203: 27.67,33.38 v27.3,33.02 | JP3.2 46.23,35.69 46.23,9.91 42.42,6.1 32,6.1 30.99,5.08 28.07,5.08 S3.1 | IC2.2 27.67,33.38 | 27.67,33.38
  Bottom 0.203: JP3.2 41.91,40.01 26.51,40.01 24.61,38.1 24.61,32.7 24.92,32.38 26.67,32.38 v27.3,33.02
DIR_1  (via drill 0.25, 0.28)
  Top 0.203: v17.46,33.34 17.01,32.88 arc90 17.01,32.89 IC4.19 | v18.28,42.18 18.52,41.94 18.52,41.43 17.46,40.36 v17.46,40.19
  Bottom 0.203: v17.46,40.19 v17.46,33.34 | JP4.1 2.54,40.32 4,41.78 17.46,41.78 17.86,42.18 v18.28,42.18
DIR_2  (via drill 0.25)
  Top 0.152: IC1.19
  Top 0.203: v18.09,19.7 v20.03,19.7 | IC1.19 26.58,17.64 26.55,17.62 | IC1.19 v27.79,17.64
  Bottom 0.152: v20.03,19.7 21.3,19.7 21.47,19.87 26.96,19.87 27.14,19.69 27.14,19.07 27.79,18.43 v27.79,17.64
  Bottom 0.203: JP4.6 4.13,25.72 4.13,21.91 5.24,20.8 10.64,20.8 12.22,19.21 16.51,19.21 16.67,19.05 17.44,19.05 v18.09,19.7
DIR_3  (via drill 0.25)
  Top 0.203: v36.51,33.02 36.35,32.86 34.17,32.86 34.2,32.88 IC2.19
  Bottom 0.203: JP3.3 40.8,34.92 38.89,33.02 v36.51,33.02
E-STOP  (via drill 0.25)
  Top 0.203: v40.96,8.57 40.96,16.35 41.75,17.14 JP3.10
  Bottom 0.152: 6.77,6.99 6.83,6.99
  Bottom 0.203: v40.96,8.57 11.92,8.57 R19.1 10.68,7.33 10.66,7.33 10.32,6.99 6.83,6.99 | S1.B 6.77,6.99
GND  (via drill 0.25, 0.28, 0.35)
  Top 0.152: C1.2 7.13,36.74 6.75,37.12 6.75,37.65 6.79,37.7 | IC2.18 40.03,32.38 41.3,33.65 41.36,33.65 v41.45,33.74 | 32.4,19.03 v32.38,19.05 | IC1.18 27.53,17.14 27.57,17.11 28.68,17.11 v29.21,17.64 | C6.2 v15.59,20.95
  Top 0.203: C7.1 32.38,19.7 v32.38,19.05
  Bottom 0.152: C16.C 39.37,10.06 39.54,9.89 42.49,9.89 v42.51,9.88 | 28.1,16.29 28.17,16.36 | 7.6,18.73 v7.57,18.76 | C20.2 29.37,16.52 R9.1 30.71,16.75 30.71,17.71 31,18 v31.16,18
  Bottom 0.305: C17.- 9.21,18.6 9.07,18.73 7.6,18.73
  other vias: 13.02,26.67 15.56,28.26 6.09,24.45 0.95,31.11 48.26,44.58 1.27,42.23 18.82,26 6.17,22.18 41.48,36.12 27.3,29.21 27.3,27.94 36.83,35.24 6.99,40.16 48.26,33.53 48.26,23.88 19.41,10.95 26.94,26.48 33.85,28.39 37.14,29.25 20.28,20.46 6.89,38.11 7.12,35.35 7.38,37.46 15.24,40.29 15.9,40.27 16.64,40.17 37.55,38.03 37.59,37.33 26.35,37.91 27.33,38.95 26.7,35.42 26.22,35.98 27.67,24.91 27.15,24.05 27.15,23.37 11.29,33.9 11.99,33.87 12.71,33.86 13.42,33.83 14.13,33.82 11.3,33.18 11.99,33.16 12.71,33.14 13.43,33.12 14.13,33.1 11.27,32.45 11.97,32.41 12.69,32.4 13.4,32.37 14.11,32.36 11.28,31.73 11.97,31.71 12.7,31.68 13.41,31.66 14.11,31.64 11.26,31.01 11.95,30.99 12.68,30.96 13.39,30.94 14.09,30.92 30.32,33.9 31.01,33.88 31.74,33.86 32.45,33.84 33.16,33.82 30.32,33.17 31.01,33.15 31.74,33.13 32.45,33.11 33.16,33.08 30.33,32.43 31.02,32.41 31.75,32.39 32.46,32.37 33.16,32.35 30.35,31.69 31.04,31.68 31.77,31.65 33.18,31.61 30.34,30.95 31.03,30.93 31.76,30.91 32.47,30.88 33.17,30.86 22.67,18.67 23.36,18.65 24.09,18.62 24.8,18.6 25.5,18.58 22.67,17.94 23.36,17.93 24.09,17.9 24.8,17.88 25.5,17.86 22.67,17.21 23.36,17.19 24.09,17.16 24.8,17.14 25.5,17.12 22.69,16.48 23.37,16.46 24.1,16.44 24.81,16.41 25.52,16.39 22.68,15.76 23.36,15.74 24.09,15.71 24.81,15.69 25.51,15.67 32.46,31.64
  pour Ground: 8.34,50 50.25,50.01 50.51,49.75 50.39,0.52 38.77,0.27 0.46,0.27 0.27,0.46 0.27,43 0.42,43.15 1.82,43.15 2.87,42.1 5.21,42.1 6.64,43.53 6.64,43.63 7.12,44.11 7.12,44.62 8.34,45.83 8.34,49.95 8.38,49.99
  pour Top (rank 2, no thermals): 0.67,49.56 50.49,49.6 50.57,10.5 41.26,1.13 0.22,1.08 0.36,49.57 0.66,49.55
  pour Bottom: 50.54,49.91 50.57,49.93 50.57,0.32 50.52,0.27 0.28,0.27 0.15,0.14 0.15,48.12 1.97,49.94
MS1_1  (via drill 0.25)
  Top 0.152: v10.79,27.94 v10.8,27.94
  Top 0.203: v5.4,29.53 4.83,30.1 4.83,35.18 JP4.2 | IC4.9 arc-90 IC4.9 11.7,28.78 11.7,28.28 11.36,27.94 v10.8,27.94
  Bottom 0.203: v5.4,29.53 6.99,27.94 v10.79,27.94
MS1_2  (via drill 0.25)
  Top 0.203: v5.87,20.16 5.87,21.43 JP4.7 | v22.86,13.49 23.13,13.76 IC1.9 | IC1.9
  Bottom 0.203: v5.87,20.16 10.48,20.16 13.97,16.67 13.97,13.81 14.29,13.49 v22.86,13.49
MS1_3  (via drill 0.25)
  Top 0.152: v40.23,26.12 40.16,26.19 | 36.14,26.12
  Top 0.203: JP3.4 40.8,32.38 40.16,31.75 40.16,26.19 | IC2.9 30.75,29.57 30.8,29.53 30.8,29.37 30.32,28.89 30.32,28.19 30.99,27.52 30.99,26.79 31.26,26.52 35.74,26.52 36.14,26.12 | 36.14,26.12 v38.51,26.12
  Bottom 0.152: v38.51,26.12
  Bottom 0.203: v38.51,26.12 v40.23,26.12
MS2_1  (via drill 0.25)
  Top 0.152: v12.06,27.62
  Top 0.203: v4.89,28.77 4.35,29.3 4.35,33.12 JP4.3 | v8.57,27.3 v8.57,28.57 | IC4.10 arc-90 IC4.10 12.2,28.68 12.06,28.54 v12.06,27.62
  Bottom 0.203: v4.89,28.77 6.35,27.3 v8.57,27.3 | v8.57,28.57 11.43,28.57 12.06,27.94 v12.06,27.62
MS2_2  (via drill 0.25)
  Top 0.203: 23.63,12.99 v23.5,12.86 23.63,12.99 IC1.10 | JP4.8 v5.24,19.53
  Bottom 0.203: v5.24,19.53 10.32,19.53 13.49,16.35 13.49,13.49 14.13,12.86 v23.5,12.86
MS2_3  (via drill 0.25)
  Top 0.203: v30.96,28.73 31.25,29.03 IC2.10 | v34.45,25.56 v34.45,20.95 | v41.59,20.95 41.59,29.05 42.39,29.84 JP3.5 | IC2.10
  Bottom 0.203: v30.96,28.73 30.16,28.73 29.69,28.26 29.69,26.51 30.16,26.04 33.18,26.04 33.34,26.19 33.81,26.19 v34.45,25.56 | v34.45,20.95 v41.59,20.95
MS3_1  (via drill 0.25)
  Top 0.152: 14.45,15.18 15.32,14.31 16.68,14.31 16.99,14 16.99,13.73 17.24,13.48 17.59,13.48 | v12.7,28.1 12.71,28.09 13.65,28.09 13.89,28.32 14.56,28.32 14.82,28.58 14.82,29 14.35,29.47 14.2,29.47 | 26.23,27.29 26.2,27.33 | 35.44,25.68 35.47,25.68 35.47,25.59
  Top 0.203: v9.21,26.67 v9.21,29.21 | 14.2,29.47 IC4.14 | 14.45,15.18 14.45,21.2 13.35,22.29 v13.27,22.29 | 35.47,25.59 v35.47,18.02 | 26.23,27.29 26.39,27.13 27.47,27.13 28.45,26.15 34.22,26.15 34.23,26.13 34.99,26.13 35.44,25.68 | 17.59,13.48 17.59,11.46 18.76,10.29 20.41,10.29 v20.41,10.31 | 26.2,27.33 v26.2,28.87
  Bottom 0.152: 32.7,9.92 32.71,9.92 | 23,9.92 23.02,9.92
  Bottom 0.203: v9.21,26.67 5.71,26.67 v5.4,26.99 5.4,23.55 6.03,22.92 12.64,22.92 v13.27,22.29 | v9.21,29.21 11.59,29.21 v12.7,28.1 | R4.1 19.21,33.35 20.83,33.35 21.14,33.04 21.14,29.78 22.2,28.71 26.04,28.71 v26.2,28.87 | 23.02,9.92 32.7,9.92 | v35.47,18.02 35.45,18 35.45,15.96 33.19,13.69 33.19,10.4 32.71,9.92 | v20.41,10.31 20.97,9.75 22.84,9.75 23,9.92
MS3_2
  Top 0.152: IC1.14 25.63,13.86 26.12,13.37 26.12,11.91 26.22,11.81 26.3,11.81 R6.2
MS3_3  (via drill 0.25)
  Top 0.152: 34.93,27.19 34.93,27.21 | 35.14,26.99 35.14,26.98
  Top 0.203: IC2.14 34.94,28.2 34.94,27.86 34.93,27.86 34.93,27.21 | 34.93,27.19 35.14,26.99 | 35.14,26.98 v36.83,26.98
  Bottom 0.152: R11.1 39.91,31.92 40.63,31.2 40.63,28.21 41.04,27.8 41.04,25.5 41.02,25.49 | 37.16,26.65
  Bottom 0.203: 37.16,26.66 37.16,26.65 37.16,25.77 37.45,25.49 41.02,25.49 | v36.83,26.98 37.16,26.65
N$1
  Top 0.203: IC1.4 17.16,17.14 C10.1
N$2
  Top 0.203: 16.66,16.64 C10.2 16.66,16.64 IC1.5
N$4
  cutout Bottom: 11.86,38.69 6.6,38.66 6.12,38.66 6.15,36.56 6.34,36.37 10.13,36.37 10.15,36.39 10.15,36.03 10.12,36 10.67,36 10.94,35.73 10.94,35.65 10.65,35.37 10.21,35.37 9.8,35.78 9.8,36 9.74,36.06 5.89,36.06 5.84,36.11 5.84,38.79 6.5,39.45 11.36,39.45 11.89,38.91
N$5
  Top 0.152: IC1.17 | 30.21,16.05 U2.WIPER
  Top 0.203: IC1.17 29.62,16.65 30.21,16.05
N$6  (via drill 0.25)
  Top 0.152: U2.3 31.75,12.76 v31.75,11.43
  Top 0.203: v31.75,11.43 31.75,12.54
  Bottom 0.203: R10.1 31.73,11.41 v31.75,11.43
N$7
  Top 0.203: C15.1 26.37,32.38 IC2.4 | IC2.4
N$8
  Top 0.203: IC2.5 25.87,31.89 C15.2
N$9
  cutout Bottom: 15.56,35.47 17.22,35.47 17.23,35.46 17.23,35.08 17.22,35.08 15.92,35.08 15.55,35.45
N$10  (via drill 0.25)
  Top 0.152: v33.28,36.17 33.02,36.17 32.75,35.89 IC2.23
  Bottom 0.152: R24.2 33.74,36.62 v33.28,36.17 | v33.28,36.17 33.27,36.16 v33.28,36.17
N$11
  Top 0.152: IC2.17 34.27,31.86
  Top 0.203: 34.27,31.86 35.45,31.86 36.02,31.3 U5.WIPER
N$12  (via drill 0.25)
  Top 0.152: v38.08,26.85 38.11,26.88 U5.3
  Bottom 0.152: R15.1 37.41,28.02
  Bottom 0.203: 37.41,28.02 37.41,27.27 37.83,26.85 v38.08,26.85
N$13
  Top 0.203: R16.1 16.81,48.26 LED1.A
N$14
  Top 0.203: R17.1 21.76,48.26 LED2.A
N$15
  Top 0.203: LED3.A 34.15,48.26 R18.1
N$16
  Top 0.152: 25.4,2.54 41.15,2.54
  Top 0.203: LED1.C 11.98,49.07 12.19,49.28 47.24,49.28 47.5,49.53 49.02,49.53 49.78,48.77 49.78,47.75 49.28,47.24 49.28,10.67 41.15,2.54 | 25.4,2.54 24.89,3.05 24.89,4.57 24.26,5.21 23.93,5.21 S2.4
N$18  (via drill 0.25)
  Top 0.203: v46.74,47.75 47.24,47.24 47.24,9.4 40.89,3.05 25.91,3.05 25.4,3.56 25.4,5.59 24.89,6.1 21.84,6.1 21.34,5.59 21.34,4.57 21.97,3.94 S2.3 22.86,4.06 | v27.29,47.75 26.79,47.75 LED2.C
  Bottom 0.203: v46.74,47.75 v27.29,47.75
N$19
  Top 0.203: LED3.C 45.21,48.26 46.74,46.74 46.74,9.65 42.16,5.08 33.15,5.08 S3.4
N$20  (via drill 0.25)
  Top 0.152: v30.42,36.04 30.77,35.69 30.77,35.66 30.75,35.64 IC2.27
  Bottom 0.152: v30.42,36.04 30.31,36.04 29.86,36.49 29.86,37.38 R25.2
N$21
  Top 0.203: C3.1 8.24,32.38 IC4.4
N$22
  Top 0.203: C3.2 8.24,30.46 8.57,30.8 8.57,31.43 9.03,31.89 IC4.5
N$23  (via drill 0.25)
  Top 0.152: IC1.23 25.11,19.66 25.11,20.2 25.41,20.5 v25.44,20.5
  Bottom 0.152: v25.44,20.5 25.44,21.71 R22.2
N$24  (via drill 0.25)
  Top 0.152: IC4.27 11.7,35.65 11.29,36.06 v11.29,36.08
  Bottom 0.152: 10.81,36.9 10.86,36.85 | R21.2 10.86,37.37 10.86,36.85 | v11.29,36.08 11.29,36.42 10.86,36.85
  pour Top (no thermals): 11.26,36.05 11.26,35.93 11.43,35.76 11.46,35.76 11.57,35.65 11.57,34.89 11.76,34.89 11.76,35.68 11.77,35.69 11.75,35.69 11.35,36.1 11.35,36.07 11.27,36
N$25
  cutout Bottom: 13.44,38.89 13.44,38.5 13.48,38.45 13.52,38.45 13.91,38.84 13.53,38.84 13.49,38.88
N$26
  Top 0.152: IC4.17 15.21,31.88
  Top 0.203: 15.21,31.88 17.09,31.88 17.68,31.3 U1.WIPER
N$27
  cutout Bottom: 14.26,36.21 14.8,36.21 14.92,36.09 14.38,36.09 14.26,36.21
N$28  (via drill 0.25)
  Top 0.152: U1.3 19.68,28 19.68,27.77
  Top 0.203: 19.68,27.77 v19.68,26.35
  Bottom 0.203: R3.1 18.24,27.8 v19.68,26.35
N$29  (via drill 0.25)
  Top 0.152: IC4.23 13.64,34.95 13.64,35.68 13.79,35.83 v13.79,36.04
  Bottom 0.152: v13.79,36.04 13.79,36.4 14.25,36.86 | 14.25,36.86 14.37,36.98 | R20.2 14.25,36.86
N$30
  cutout Bottom: 35.65,35.62 37.8,35.62 37.97,35.79 37.97,36.08 37.94,36.11 36.07,36.11 35.58,35.62
N$31
  cutout Bottom: 37.83,39.7 38.1,39.7 38.67,39.13 38.32,39.13 37.77,39.67
N$32  (via drill 0.25)
  Top 0.152: v22.9,20.51 23.13,20.28 IC1.27
  Bottom 0.152: v22.9,20.51 22.9,21.74 R23.2
N$33
  cutout Bottom: 32.02,39.73 32.02,35.81 31.6,35.81 31.57,35.77 31.57,39.66 31.63,39.72 31.99,39.72 32.01,39.74
N$34
  cutout Bottom: 27.39,19.55 27.71,19.55 29.23,21.07 29.23,25.24 29.26,25.27 28.97,25.27 28.96,25.26 28.96,21.08 27.44,19.56
N$35
  cutout Bottom: 23.45,23.84 23.45,25.16 23.59,25.3 24,25.3 24.21,25.1 24.21,24.06 24.21,23.94 24.13,23.86 23.51,23.86 23.43,23.78
ROSC1  (via drill 0.25)
  Top 0.203: v13.97,28.89 13.7,29.16 IC4.13 | v13.97,27.62 13.97,26.68 R5.2
  Bottom 0.203: v13.97,28.89 v13.97,27.62
ROSC2  (via drill 0.25 pad 0.3)
  Top 0.203: v25.07,13.23 25.07,13.81 25.15,13.9 25.15,14.63 IC1.13
  Bottom 0.152: 25.47,12.83 25.49,12.83 25.5,12.82 25.59,12.82
  Bottom 0.203: R9.2 30.48,14.92 28.89,13.34 28.55,13.34 28.04,12.82 25.59,12.82 25.48,12.82 | 25.47,12.83 v25.07,13.23
ROSC3
  Top 0.203: IC2.13 32.75,28.84 32.33,28.42 32.33,27.34 R14.2
STP_1  (via drill 0.25)
  Top 0.203: v33.66,23.02 v33.66,25.56 | v20.16,29.69 17.94,29.69 17.46,30.16 17.46,30.96 16.99,31.43 16.19,31.43 | 16.19,31.43 15.15,31.43 | IC4.16 16.14,31.39 arc90 16.19,31.43
  Bottom 0.203: JP3.7 42.07,24.77 40.32,23.02 v33.66,23.02 | v33.66,25.56 22.38,25.56 20.8,27.15 20.8,29.05 v20.16,29.69
STP_2  (via drill 0.25)
  Top 0.203: v33.66,22.23 33.5,22.07 33.5,15.08 32.54,14.13 30,14.13 27.99,16.14 IC1.16
  Bottom 0.203: v33.66,22.23 JP3.8
STP_3  (via drill 0.25)
  Top 0.203: v35.4,30.8 34.81,31.39 IC2.16 | v42.55,28.57 42.55,21.59 JP3.9 | IC2.16
  Bottom 0.152: 37.47,32.54 37.48,32.55 | v42.55,28.57 42.55,30.3
  Bottom 0.203: v35.4,30.8 35.72,30.8 37.47,32.54 | 37.48,32.55 40.29,32.55 42.55,30.3
VCP_1  (via drill 0.25)
  Top 0.203: v9.21,30.16 9.21,31.11 9.53,31.43 10.25,31.43 IC4.6
  Bottom 0.203: v9.21,30.16 8.24,30.16 7.94,30.46 C4.1
VCP_2  (via drill 0.25)
  Top 0.203: 18.68,16.14 v18.57,16.03 18.68,16.14 IC1.6
  Bottom 0.203: C9.1 18.11,16.5 v18.57,16.03
VCP_3  (via drill 0.25)
  Top 0.203: v26.67,31.27 26.78,31.39 | v26.67,31.27 26.78,31.39 | IC2.6 26.78,31.39 | 26.78,31.39 v26.67,31.27
  Bottom 0.203: C14.1 26.21,31.73 v26.67,31.27
VREG1
  Top 0.152: C5.1 10.41,26.72 | 10.09,29.47 10.6,29.98 11.1,29.98
  Top 0.203: 10.32,26.67 C5.1 | 10.62,29.98 11.1,29.98 11.2,29.98 IC4.8 | 10.41,26.72 10.41,27.33 10.28,27.46 10.06,27.46 9.75,27.77 9.75,28.31 10.09,28.64 10.09,29.47
VREG2
  Top 0.203: C8.1 22.21,14.32 22.31,14.32 IC1.8
VREG3
  Top 0.203: C13.1 29.86,29.59 29.96,29.59 IC2.8

### Text on the board
tNames: - | - | - | LED1 | LED2 | LED3 | DIR_1 | AEN_1 | MS1_1 | AEN_3 | MS2_1 | DIR_3 | MS1_3 | MS2_3 | AEN_2 | DIR_2 | MS3_3 | MS1_2 | STP_1 | MS2_2 | STP_2 | MS3_2 | STP_3 | GND | E-Stop | 12V | 5V | 12V | GND